# EAGLE design mapleCUx_large_056 (EAGLE 7.3.0)
MAPLE-CUx Large Version
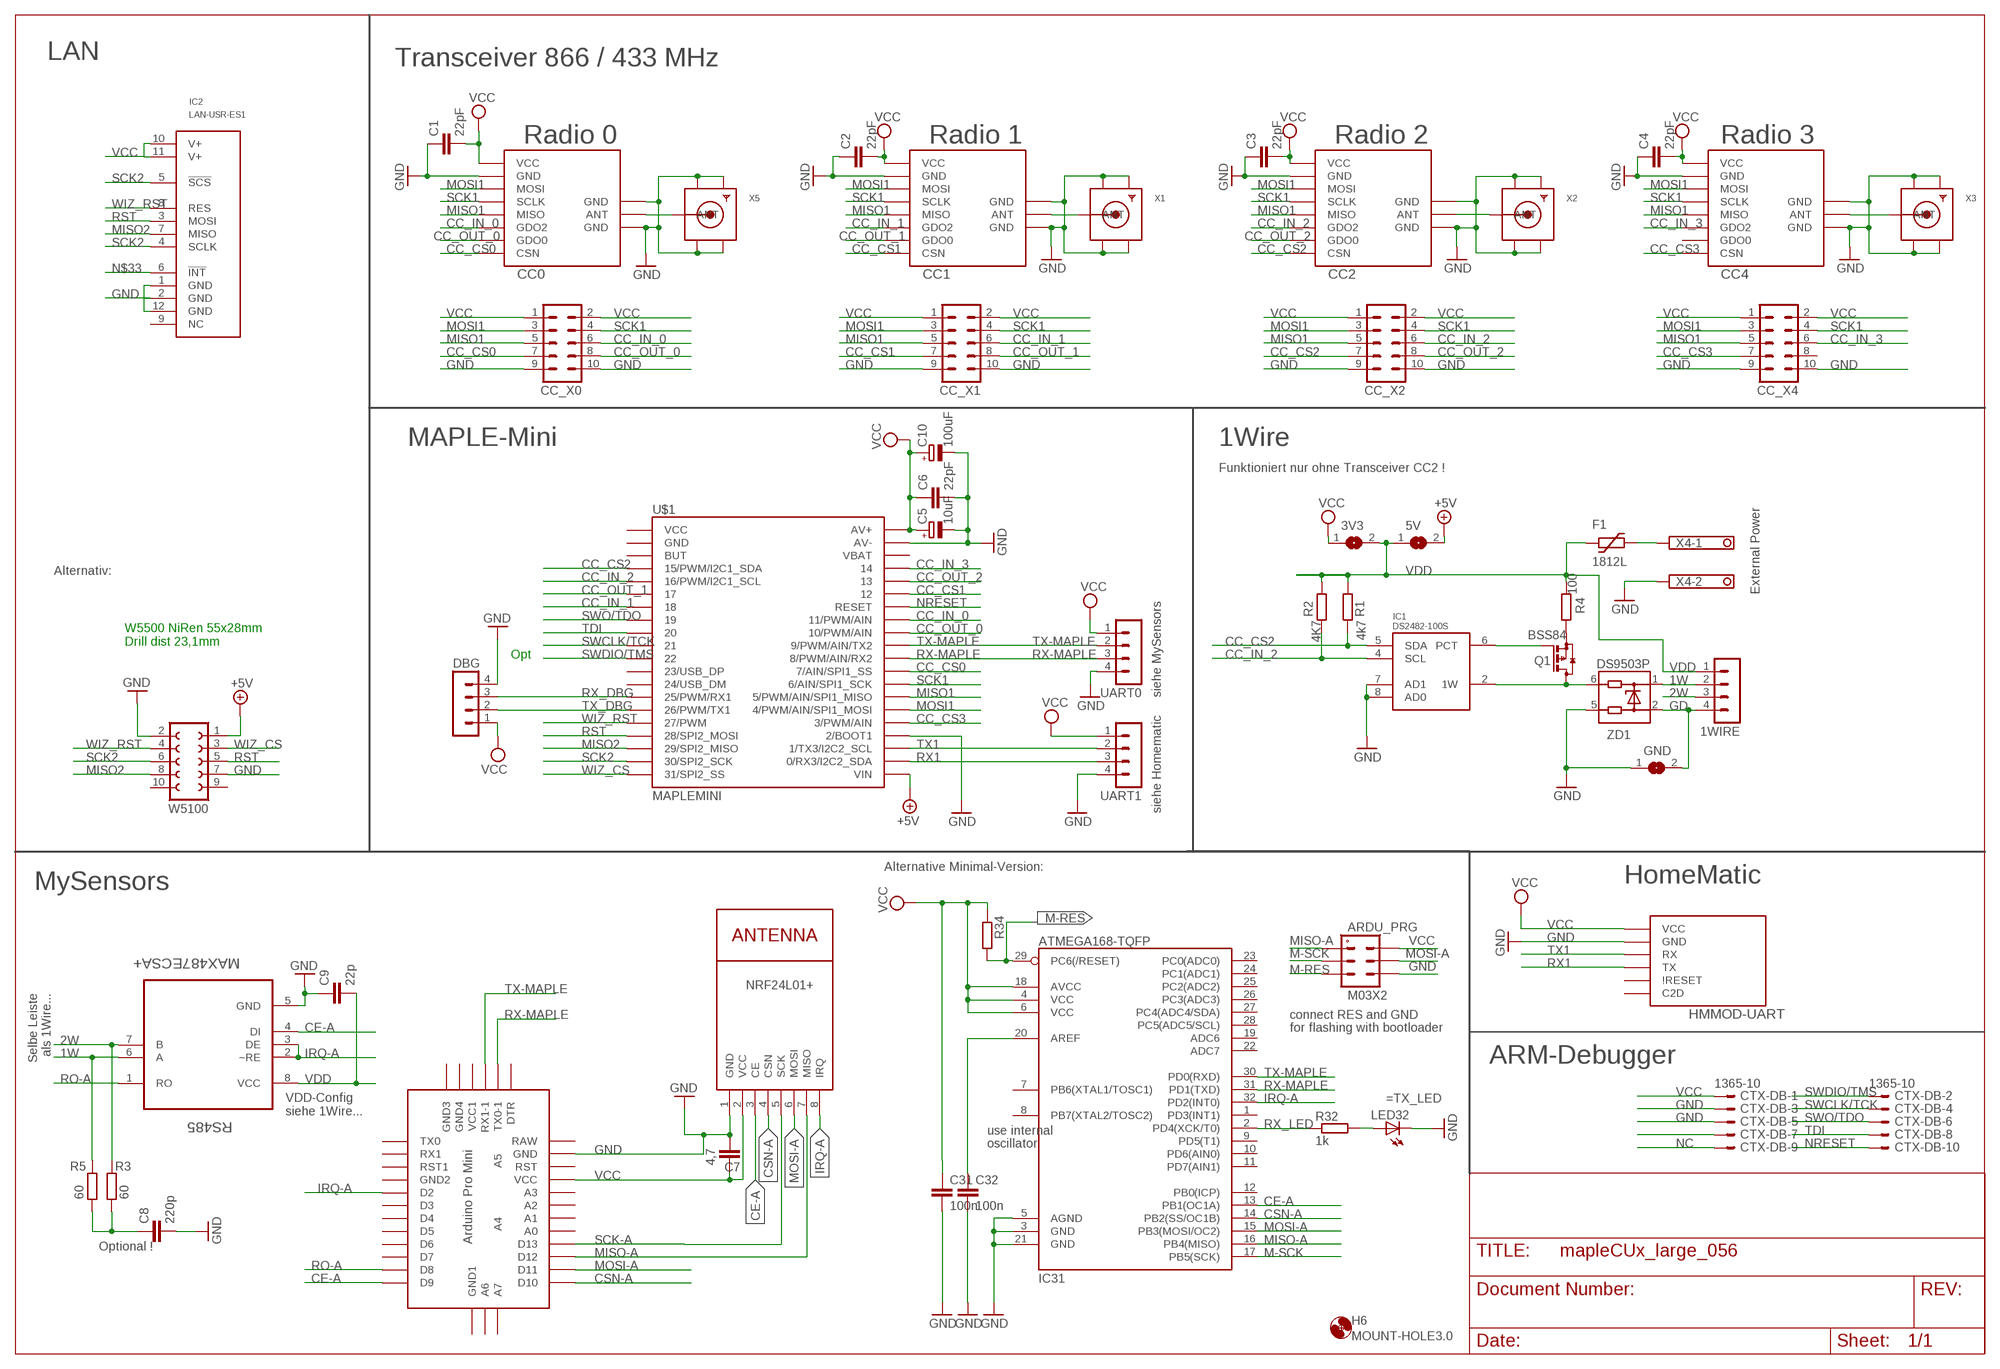
[diagram p0: schematic, sheet 1]

## Parts
1WIRE  MA04-1  [MA04-1]
3V3  SJ  [SJ]
5V  SJ  [SJ]
ARDU_PRG  M03X2  [2X03-1.27MM_SMD]
C1  22pF  C-EUC0805  [C0805]
C2  22pF  C-EUC0805  [C0805]
C3  22pF  C-EUC0805  [C0805]
C4  22pF  C-EUC0805  [C0805]
C5  10uF  CPOL-EUR/2012-12W  [R/2012-12W]
C6  22pF  C-EUC0805  [C0805]
C7  4,7  C-EUC1210  [C1210]
C8  220p  C-EUC0805  [C0805]
C9  22p  C-EUC0805  [C0805]
C10  100uF  CPOL-EUE5-8.5  [E5-8,5]
C31  100n  C-EUC0805  [C0805]
C32  100n  C-EUC0805  [C0805]
CC0  CC1101_MODULE1SMD  [CC1101_MODULE1_SMD]
CC1  CC1101_MODULE1SMD  [CC1101_MODULE1_SMD]
CC2  CC1101_MODULE1SMD  [CC1101_MODULE1_SMD]
CC4  CC1101_MODULE1SMD  [CC1101_MODULE1_SMD]
CC_X0  MA05-2  [MA05-2]
CC_X1  MA05-2  [MA05-2]
CC_X2  MA05-2  [MA05-2]
CC_X4  MA05-2  [MA05-2]
CTX-DB  1365-10  [1365-10]
DBG  MA04-1  [MA04-1]
F1  1812L  [1812L]
GND  SJ  [SJ]
H6  MOUNT-HOLE3.0  [3,0]
HMMOD-UART  HM-MOD-UARTDIL  [HM-MOD-UART-DIL]
IC1  DS2482-100S  [SO08]
IC2  LAN-USR-ES1  [USR-ES1]
IC31  ATMEGA168-TQFP  [TQFP32-08]
LED32  LEDCHIPLED_0805  [CHIPLED_0805]
NRF24L01+  NRF24L01+  WIRELESS-NRF24L01  [WIRELESS-NRF24L01]
Q1  BSS84  [SOT23]
R1  4k7  R-EU_R0805  [R0805]
R2  4K7  R-EU_R0805  [R0805]
R3  60  R-EU_R0805  [R0805]
R4  100  R-EU_R0805  [R0805]
R5  60  R-EU_R0805  [R0805]
R32  1k  R-EU_R0805  [R0805]
R34  R-EU_R0805  [R0805]
RS485  MAX487ECSA+  [SOIC127P600X175-8N]
U$1  MAPLEMINI  [20-DIP]
U$2  ABK-PRO-MINI  [ABK-PRO-MINI]
UART0  MA04-1  [MA04-1]
UART1  MA04-1  [MA04-1]
W5100  FE05-2  [FE05-2]
X1  SMACONNECTOR_EDGE_UFL  [SMA_EDGELAUNCH_UFL]
X2  SMACONNECTOR_EDGE_UFL  [SMA_EDGELAUNCH_UFL]
X3  SMACONNECTOR_EDGE_UFL  [SMA_EDGELAUNCH_UFL]
X4  1751248  [1751248]
X5  SMACONNECTOR_EDGE_UFL  [SMA_EDGELAUNCH_UFL]
ZD1  DS9503P  [TSOC6]

## Nets
1W: 1WIRE.2 R5.2 RS485.6(A) ZD1.1
2W: 1WIRE.3 R3.2 RS485.7(B)
+5V [PWR]: 5V.2 U$1.21(VIN) W5100.1
CC_CS0: CC0.CSN CC_X0.7 U$1.29(7/AIN/SPI1_SS)
CC_CS1: CC1.CSN CC_X1.7 U$1.35
CC_CS2: CC2.CSN CC_X2.7 IC1.5(SDA) R1.2 U$1.4(15/PWM/I2C1_SDA)
CC_CS3: CC4.CSN CC_X4.7 U$1.25(3/PWM/AIN)
CC_IN_0: CC0.GDO2 CC_X0.6 U$1.33(11/PWM/AIN)
CC_IN_1: CC1.GDO2 CC_X1.6 U$1.7
CC_IN_2: CC2.GDO2 CC_X2.6 IC1.4(SCL) R2.2 U$1.5(16/PWM/I2C1_SCL)
CC_IN_3: CC4.GDO2 CC_X4.6 U$1.37
CC_OUT_0: CC0.GDO0 CC_X0.8 U$1.32(10/PWM/AIN)
CC_OUT_1: CC1.GDO0 CC_X1.8 U$1.6
CC_OUT_2: CC2.GDO0 CC_X2.8 U$1.36
CE-A: IC31.13(PB1(OC1A)) NRF24L01+.3(CE) RS485.4(DI) U$2.D9
CSN-A: IC31.14(PB2(SS/OC1B)) NRF24L01+.4(CSN) U$2.D10
GD [PWR]: 1WIRE.4 GND.2 ZD1.2
GND [PWR]: ARDU_PRG.P$6 C1.1 C2.1 C3.1 C4.1 C5.- C6.2 C7.1 C8.2 C9.1 C10.- C31.2 C32.2 CC0.GND@0(GND) CC0.GND@1(GND) CC0.GND@2(GND) CC1.GND@0(GND) CC1.GND@1(GND) CC1.GND@2(GND) CC2.GND@0(GND) CC2.GND@1(GND) CC2.GND@2(GND) CC4.GND@0(GND) CC4.GND@1(GND) CC4.GND@2(GND) CC_X0.9 CC_X0.10 CC_X1.9 CC_X1.10 CC_X2.9 CC_X2.10 CC_X4.9 CC_X4.10 CTX-DB.3 CTX-DB.5 DBG.4 GND.1 HMMOD-UART.2(GND) IC1.7(AD1) IC1.8(AD0) IC2.1(GND) IC2.2(GND) IC2.12(GND) IC31.3(GND) IC31.5(AGND) IC31.21(GND) LED32.C NRF24L01+.1(GND) RS485.5(GND) U$1.24(2/BOOT1) U$1.39(AV-) U$2.GND UART0.4 UART1.4 W5100.2 W5100.7 X1.GND@1(GND1) X1.GND@2(GND2) X1.GND@3(GND3) X1.GND@4(GND4) X2.GND@1(GND1) X2.GND@2(GND2) X2.GND@3(GND3) X2.GND@4(GND4) X3.GND@1(GND1) X3.GND@2(GND2) X3.GND@3(GND3) X3.GND@4(GND4) X4.2 X5.GND@1(GND1) X5.GND@2(GND2) X5.GND@3(GND3) X5.GND@4(GND4) ZD1.5
IRQ-A: IC31.32(PD2(INT0)) NRF24L01+.8(IRQ) RS485.2(~RE) RS485.3(DE) U$2.D2
M-RES: ARDU_PRG.P$5 IC31.29(PC6(/RESET)) R34.2
M-SCK: ARDU_PRG.P$3 IC31.17(PB5(SCK))
MISO1: CC0.MISO CC1.MISO CC2.MISO CC4.MISO CC_X0.5 CC_X1.5 CC_X2.5 CC_X4.5 U$1.27(5/PWM/AIN/SPI1_MISO)
MISO2: IC2.7(MISO) U$1.18(29/SPI2_MISO) W5100.8
MISO-A: ARDU_PRG.P$1 IC31.16(PB4(MISO)) NRF24L01+.7(MISO) U$2.D12
MOSI1: CC0.MOSI CC1.MOSI CC2.MOSI CC4.MOSI CC_X0.3 CC_X1.3 CC_X2.3 CC_X4.3 U$1.26(4/PWM/AIN/SPI1_MOSI)
MOSI-A: ARDU_PRG.P$4 IC31.15(PB3(MOSI/OC2)) NRF24L01+.6(MOSI) U$2.D11
N$1: CC1.ANT X1.P(ANT)
N$2: CC4.ANT X3.P(ANT)
N$3: CC2.ANT X2.P(ANT)
N$4: CC0.ANT X5.P(ANT)
N$5: LED32.A R32.2
N$8: CTX-DB.7
N$15: C32.1 IC31.20(AREF)
N$21: C8.1 R3.1 R5.1
N$33: IC2.6(!INT!)
N$45 [PWR]: F1.P$2 X4.1
N$47: IC1.6(PCT) Q1.1(G)
N$48: IC1.2(1W) Q1.3(D) ZD1.6
N$52: Q1.2(S) R4.1
NC: CTX-DB.9
NRESET: CTX-DB.10 U$1.34(RESET)
RO-A: RS485.1(RO) U$2.D8
RST: IC2.3(MOSI) U$1.17(28/SPI2_MOSI) W5100.5
RX1: HMMOD-UART.5(TX) U$1.22(0/RX3/I2C2_SDA) UART1.3
RX-MAPLE: IC31.31(PD1(TXD)) U$1.30(8/PWM/AIN/RX2) U$2.TX0-1 UART0.3
RX_DBG: DBG.3 U$1.14(25/PWM/RX1)
RX_LED: IC31.2(PD4(XCK/T0)) R32.1
SCK1: CC0.SCLK CC1.SCLK CC2.SCLK CC4.SCLK CC_X0.4 CC_X1.4 CC_X2.4 CC_X4.4 U$1.28(6/AIN/SPI1_SCK)
SCK2: IC2.4(SCLK) IC2.5(!SCS!) U$1.19(30/SPI2_SCK) W5100.6
SCK-A: NRF24L01+.5(SCK) U$2.D13
SWCLK/TCK: CTX-DB.4 U$1.10
SWDIO/TMS: CTX-DB.2 U$1.11
SWO/TDO: CTX-DB.6 U$1.8
TDI: CTX-DB.8 U$1.9
TX1: HMMOD-UART.6(RX) U$1.23(1/TX3/I2C2_SCL) UART1.2
TX-MAPLE: IC31.30(PD0(RXD)) U$1.31(9/PWM/AIN/TX2) U$2.RX1-1 UART0.2
TX_DBG: DBG.2 U$1.15(26/PWM/TX1)
VCC [PWR]: 3V3.1 ARDU_PRG.P$2 C1.2 C2.2 C3.2 C4.2 C5.+ C6.1 C7.2 C10.+ C31.1 CC0.VCC CC1.VCC CC2.VCC CC4.VCC CC_X0.1 CC_X0.2 CC_X1.1 CC_X1.2 CC_X2.1 CC_X2.2 CC_X4.1 CC_X4.2 CTX-DB.1 DBG.1 HMMOD-UART.1(VCC) IC2.10(V+) IC2.11(V+) IC31.4(VCC) IC31.6(VCC) IC31.18(AVCC) NRF24L01+.2(VCC) R34.1 U$1.40(AV+) U$2.VCC UART0.1 UART1.1
VDD [PWR]: 1WIRE.1 3V3.2 5V.1 C9.2 F1.P$1 R1.1 R2.1 R4.2 RS485.8(VCC)
WIZ_CS: U$1.20(31/SPI2_SS) W5100.3
WIZ_RST: IC2.8(RES) U$1.16(27/PWM) W5100.4
Unconnected: CC4.GDO0 CC_X4.8 HMMOD-UART.3(C2D) HMMOD-UART.4(\!RESET) IC2.9(NC) IC31.1(PD3(INT1)) IC31.7(PB6(XTAL1/TOSC1)) IC31.8(PB7(XTAL2/TOSC2)) IC31.9(PD5(T1)) IC31.10(PD6(AIN0)) IC31.11(PD7(AIN1)) IC31.12(PB0(ICP)) IC31.19(ADC6) IC31.22(ADC7) IC31.23(PC0(ADC0)) IC31.24(PC1(ADC1)) IC31.25(PC2(ADC2)) IC31.26(PC3(ADC3)) IC31.27(PC4(ADC4/SDA)) IC31.28(PC5(ADC5/SCL)) U$1.1(VCC) U$1.2(GND) U$1.3(BUT) U$1.12(23/USB_DP) U$1.13(24/USB_DM) U$1.38(VBAT) U$2.A0 U$2.A1 U$2.A2 U$2.A3 U$2.A4 U$2.A5 U$2.A6 U$2.A7 U$2.D3 U$2.D4 U$2.D5 U$2.D6 U$2.D7 U$2.DTR U$2.GND1(GND2) U$2.GND2(GND3) U$2.GND3(GND4) U$2.GND4(GND1) U$2.RAW U$2.RST U$2.RST1 U$2.RX1 U$2.TX0 U$2.VCC1 W5100.9 W5100.10

## Notes on the sheet
- LAN | Transceiver 866 / 433 MHz
- Radio 0 | Radio 1 | Radio 2 | Radio 3
- MAPLE-Mini | 1Wire
- Funktioniert nur ohne Transceiver CC2 !
- Alternativ:
- External Power
- W5500 NiRen 55x28mm
  Drill dist 23,1mm
- Opt
- siehe MySensors
- siehe Homematic
- Alternative Minimal-Version:
- MySensors | HomeMatic
- Selbe Leiste
  als 1Wire...
- connect RES and GND
- for flashing with bootloader
- ARM-Debugger
- =TX_LED
- VDD-Config
  siehe 1Wire...
- use internal
- oscillator
- Optional !

## Power pins joined to a net without a drawn wire
GND: IC1.3(GND)
VDD: IC1.1(VDD)

## Library data of the parts
1WIRE DBG UART0 UART1 = con-lstb:MA04-1: PIN HEADER; OC_FARNELL: unknown; OC_NEWARK: unknown
3V3 5V GND = jumper:SJ: SMD solder JUMPER
ARDU_PRG = mechanics:M03X2
C1-C4 C6-C9 C31 C32 = rcl:C-EU: CAPACITOR, European symbol
C5 C10 = rcl:CPOL-EU: POLARIZED CAPACITOR, European symbol
CC0 CC1 CC2 CC4 = wireless:CC1101_MODULE1: CC1101 wireless module for 433/868 MHz (sold from Aliexpress). DIL version for mounting with pin header (and SMD soldering) and SMD only variant available.
CC_X0 CC_X1 CC_X2 CC_X4 = con-lstb:MA05-2: PIN HEADER; OC_FARNELL: unknown; OC_NEWARK: unknown
CTX-DB = con-leotronics:1365-10: DUAL ROW STRAIGHT HEADER 1364 SERIES. 1.27mm x 1.27mm. Without Fixing Post. SMT Source: http://www.leotronics.co.uk/Conexcon/Data%20Sheets/sec.%20A/1364ing.pdf; OC_FARNELL: unknown; OC_NEWARK: unknown
F1 = ptc-littlefuse:1812L
H6 = holes:MOUNT-HOLE: MOUNTING HOLE with drill center marker
HMMOD-UART = wireless:HM-MOD-UART: eQ3 HM-MOD-UART-AW-SH2 wireless module for 868 MHz. DIL version for mounting with pin header (antenna upwards) and SMD variant available (antenna downwards).
IC1 = 1wire:DS2482-100: I2C to 1-Wire Host Adapter/Line Driver This device is a onewire host and I2C interface in one chip. It provides the complete DC/AC requirements for onewire communication, including overdrive speed mode, but, unlike the DS2480B chip, no 12V EPROM programming. Notes: For overdrive speed and 5V EEPROM programming, an external active pullup circuit must be connected to the 1W, VDD and PCT pin. See the datasheet for details. The lower two I2C adress bits of the chip can be selected by external pins, so up to 4 chips may be connected to the same I2C bus. Author: Orginal device and description from Giovanni Varasano <giovanni.varasano@fastwebnet.it> Improved by Jan Kandziora <jjj@gmx.de>
IC2 = Martin-Communication:LAN-USR-ES1
IC31 = atmel:ATMEGA168: Atmel Atmega 168/328/328P
LED32 = led:LED: LED OSRAM: - CHIPLED LG R971, LG N971, LY N971, LG Q971, LY Q971, LO R971, LY R971 LH N974, LH R974 LS Q976, LO Q976, LY Q976 LO Q996 - Hyper CHIPLED LW Q18S LB Q993, LB Q99A, LB R99A - SideLED LS A670, LO A670, LY A670, LG A670, LP A670 LB A673, LV A673, LT A673, LW A673 LH A674 LY A675 LS A676, LA A676, LO A676, LY A676, LW A676 LS A679, LY A679, LG A679 - Hyper Micro SIDELED® LS Y876, LA Y876, LO Y876, LY Y876 LT Y87S - SmartLED LW L88C, LW L88S LB L89C, LB L89S, LG L890 LS L89K, LO L89K, LY L89K LS L896, LA L896, LO L896, LY L896 - TOPLED LS T670, LO T670, LY T670, LG T670, LP T670 LSG T670, LSP T670, LSY T670, LOP T670, LYG T670 LG T671, LOG T671, LSG T671 LB T673, LV T673, LT T673, LW T673 LH T674 LS T676, LA T676, LO T676, LY T676, LB T676, LH T676, LSB T676, LW T676 LB T67C, LV T67C, LT T67C, LS T67K, LO T67K, LY T67K, LW E67C LS E67B, LA E67B, LO E67B, LY E67B, LB E67C, LV E67C, LT E67C LW T67C LS T679, LY T679, LG T679 LS T770, LO T770, LY T770, LG T770, LP T770 LB T773, LV T773, LT T773, LW T773 LH T774 LS E675, LA E675, LY E675, LS T675 LS T776, LA T776, LO T776, LY T776, LB T776 LHGB T686 LT T68C, LB T68C - Hyper Mini TOPLED® LB M676 - Mini TOPLED Santana® LG M470 LS M47K, LO M47K, LY M47K Source: http://www.osram.convergy.de LUXEON: - LUMILED® LXK2-PW12-R00, LXK2-PW12-S00, LXK2-PW14-U00, LXK2-PW14-V00 LXK2-PM12-R00, LXK2-PM12-S00, LXK2-PM14-U00 LXK2-PE12-Q00, LXK2-PE12-R00, LXK2-PE12-S00, LXK2-PE14-T00, LXK2-PE14-U00 LXK2-PB12-K00, LXK2-PB12-L00, LXK2-PB12-M00, LXK2-PB14-N00, LXK2-PB14-P00, LXK2-PB14-Q00 LXK2-PR12-L00, LXK2-PR12-M00, LXK2-PR14-Q00, LXK2-PR14-R00 LXK2-PD12-Q00, LXK2-PD12-R00, LXK2-PD12-S00 LXK2-PH12-R00, LXK2-PH12-S00 LXK2-PL12-P00, LXK2-PL12-Q00, LXK2-PL12-R00 Source: www.luxeon.com KINGBRIGHT: KA-3528ASYC Source: www.kingbright.com
NRF24L01+ = diy-modules:WIRELESS-NRF24L01: 2.4 GHz Wireless Module based on NRF24L01 chip
Q1 = transistor-small-signal:BSS84: P-CHANNEL MOS FET
R1-R5 R32 R34 = rcl:R-EU_: RESISTOR, European symbol
RS485 = Maxim_By_element14_Batch_1:MAX487ECSA+: Low-Power, Slew-Rate-Limited RS-485/RS-422 Transceivers; MPN: MAX487ECSA+; OC_FARNELL: 9724532; OC_NEWARK: 68K4803; PACKAGE: SOIC-8; SUPPLIER: Maxim
U$1 = maplemini-small:MAPLEMINI
U$2 = Arduino-clone:ABK-PRO-MINI: ABK Pro-Mini Arduino Clone
W5100 = con-lsta:FE05-2: FEMALE HEADER; OC_FARNELL: unknown; OC_NEWARK: unknown
X1-X3 X5 = adafruit:SMACONNECTOR: SMA Connector 90° DIP SMA Connector, 50 Ohm (4UConnector: 07259)
X4 = con-phoenix-350:1751248: MKDS 1/ 2-3,5 Printklemme Nennstrom: 10 A Bemessungsspannung: 160 V Raster: 3,5 mm Polzahl: 2 Montageart: Löten Anschlussart: Schraubanschluss Anschlussrichtung vom Leiter zur Platine: 0° Source: http://eshop.phoenixcontact.com .. 1751248.pdf; OC_FARNELL: unknown; OC_NEWARK: unknown
ZD1 = 1wire:DS9503: ESD Protection Diode with Resistors This ESD protection diode is designed especially for onewire host interfaces. Unlike the DS9502, it has two additional 5Ohm resitors in the 1W and GND line. Pin 5 and 6 have to be connected to the host side, pin 1 und 2 to the network side. The 1W line is through pin 1 and 6, the GND line is through pin 2 and 5. Author: Jan Kandziora <jjj@gmx.de>

## Net classes
1 PWR: width 0.508 mm

## Board
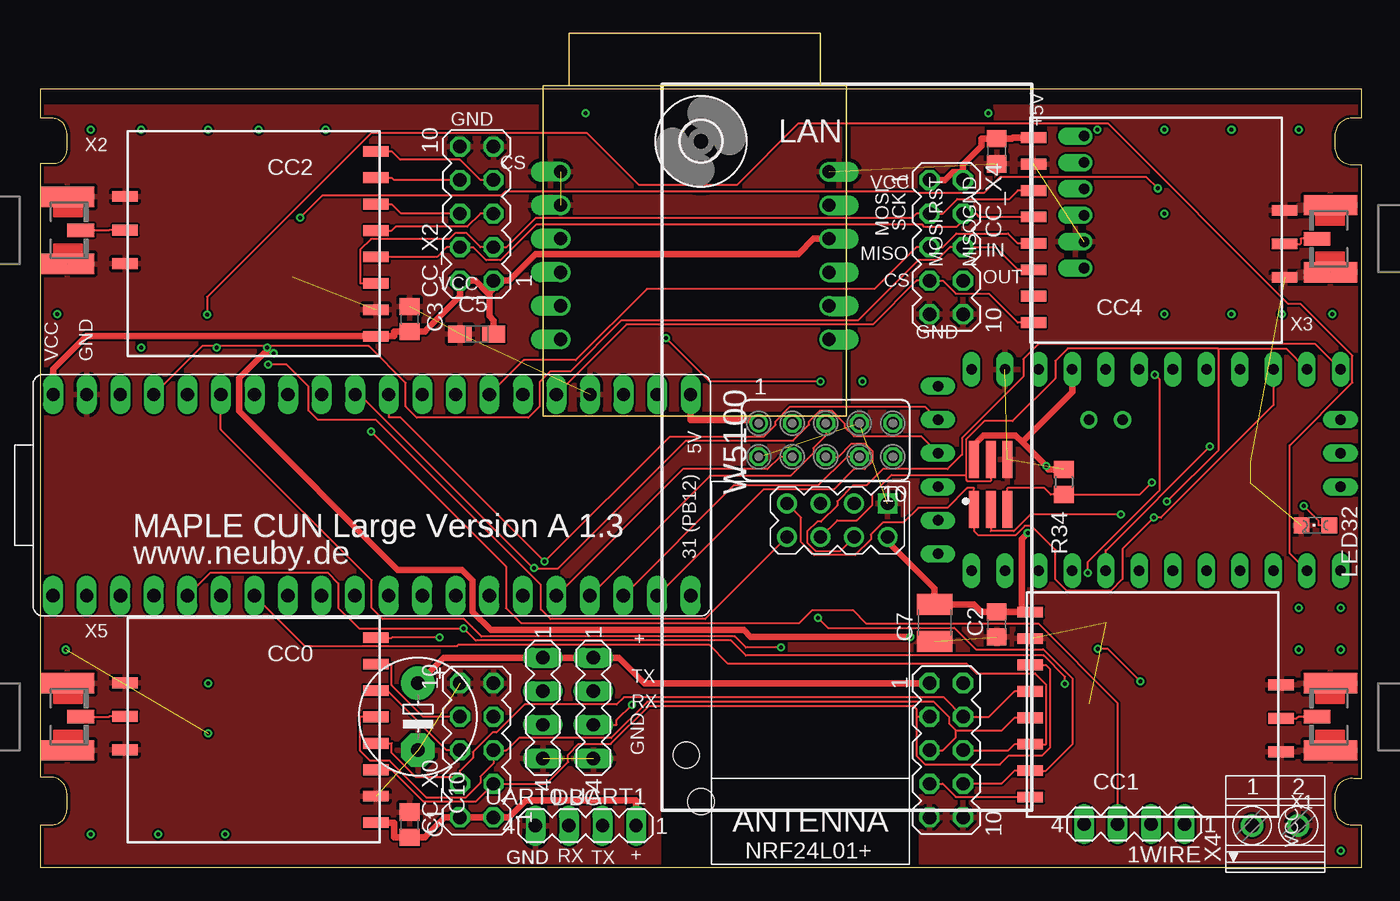
[diagram p1: board, top side]
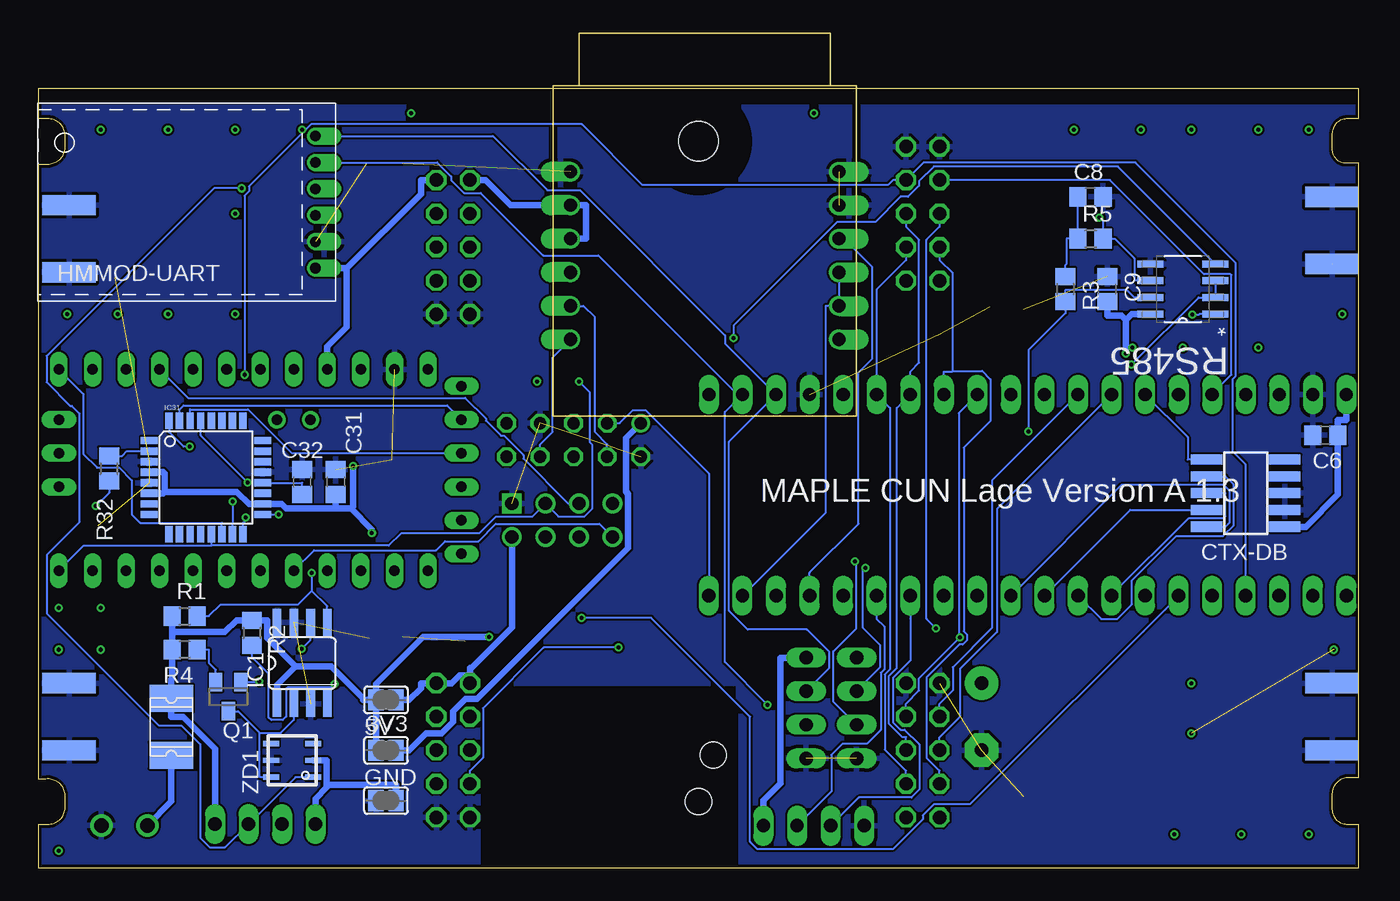
[diagram p2: board, bottom side, seen from below]

Size 100 x 59 mm. Coordinates in mm from the lower left corner, seen from the top.
Outline: 0,0 0,3.25 0.84,3.25 arc90 2,4.41 2,5.59 arc90 0.76,6.86 0,6.86 0,53.34 1.02,53.34 arc90 2,54.41 2,55.59 arc90 0.84,56.75 0,56.75 0,59 100,59 100,56.75 99.41,56.75 arc90 98,55.59 98,54.41 arc90 99.41,53.25 100,53.25 100,6.75 99.41,6.75 arc90 98,5.59 98,4.41 arc90 99.41,3.25 100,3.25 100,0 0,0
Copper layers (1*16): Top 0.035mm / dielectric 1.5mm / Bottom 0.035mm
Design rules "SeeedStudio_2layer_DRU_no_angle_20140221": minimum track width 6mil, minimum drill 12mil, track to track 6mil, track to pad 6mil, pad to pad 6mil, via to via 6mil, smd to smd 0mil, copper to edge 10mil, drill to drill 10mil, minimum pad ring 10mil, minimum via ring 6mil, stop-mask expansion 2mil, vias tented up to drill 100mil, thermal gap 10mil
Holes 2 mm at 48.9,8.53 50,5
tRestrict: area 0,58 to 100,59; area 47,0 to 66,12
bRestrict: area 0,58 to 100,59; area 0,58 to 100,59; area 47,0 to 66,12

### Footprints (pad centres in the part's own frame; a part is rotated, then mirrored left to right if it is on the bottom)
MA04-1 = drill 1.016 long: 1 -3.81,0; 2 -1.27,0; 3 1.27,0; 4 3.81,0
SJ = smd 1.168 x 1.6: 1 -0.762,0; 2 0.762,0
2X03-1.27MM_SMD = smd 0.75 x 2.8: P$1 -1.27,-1.905; P$2 -1.27,1.905; P$3 0,-1.905; P$4 0,1.905; P$5 1.27,-1.905; P$6 1.27,1.905
C0805 = smd 1.3 x 1.5: 1 -0.95,0; 2 0.95,0
R/2012-12W = smd 1.75 x 1.26: + 1.275,0; - -1.275,0
C1210 = smd 1.6 x 2.7: 1 -1.4,0; 2 1.4,0
E5-8,5 = drill 1.016 pad 2.54: + -2.54,0 | drill 1.016 pad 2.54 octagon: - 2.54,0
CC1101_MODULE1_SMD = smd 1.93 x 0.813: ANT 19,5.96; CSN 0,0; GDO0 0,2; GDO2 0,4; GND@0 0,12; GND@1 19,8.5; GND@2 19,3.42; MISO 0,6; MOSI 0,10; SCLK 0,8; VCC 0,14
MA05-2 = drill 1.016 octagon: 1 -5.08,-1.27; 2 -5.08,1.27; 3 -2.54,-1.27; 4 -2.54,1.27; 5 0,-1.27; 6 0,1.27; 7 2.54,-1.27; 8 2.54,1.27; 9 5.08,-1.27; 10 5.08,1.27
1365-10 = smd 0.76 x 2.4: 1 -2.54,-2.95; 2 -2.54,2.95; 3 -1.27,-2.95; 4 -1.27,2.95; 5 0,-2.95; 6 0,2.95; 7 1.27,-2.95; 8 1.27,2.95; 9 2.54,-2.95; 10 2.54,2.95
1812L = smd 2.03 x 3.3: P$1 -2.16,0; P$2 2.16,0
3,0 = hole 3: 0,0
HM-MOD-UART-DIL = drill 0.8 offset: 1 0,12; 2 0,10; 3 0,8; 4 0,6; 5 0,4; 6 0,2
SO08 = smd 0.66 x 2.032: 1 -1.905,-3.073; 2 -0.635,-3.073; 3 0.635,-3.073; 4 1.905,-3.073; 5 1.905,3.073; 6 0.635,3.073; 7 -0.635,3.073; 8 -1.905,3.073
USR-ES1 = drill 1 pad 1.35 offset: 1 -10.16,5.715; 2 -10.16,3.175; 3 -10.16,0.635; 4 -10.16,-1.905; 5 -10.16,-4.445; 6 -10.16,-6.985; 7 10.16,-6.985; 8 10.16,-4.445; 9 10.16,-1.905; 10 10.16,0.635; 11 10.16,3.175; 12 10.16,5.715
TQFP32-08 = smd 1.27 x 0.559: 1 -4.293,2.8; 2 -4.293,2; 3 -4.293,1.2; 4 -4.293,0.4; 5 -4.293,-0.4; 6 -4.293,-1.2; 7 -4.293,-2; 8 -4.293,-2.8; 17 4.293,-2.8; 18 4.293,-2; 19 4.293,-1.2; 20 4.293,-0.4; 21 4.293,0.4; 22 4.293,1.2; 23 4.293,2; 24 4.293,2.8 | smd 0.559 x 1.27: 9 -2.8,-4.293; 10 -2,-4.293; 11 -1.2,-4.293; 12 -0.4,-4.293; 13 0.4,-4.293; 14 1.2,-4.293; 15 2,-4.293; 16 2.8,-4.293; 25 2.8,4.293; 26 2,4.293; 27 1.2,4.293; 28 0.4,4.293; 29 -0.4,4.293; 30 -1.2,4.293; 31 -2,4.293; 32 -2.8,4.293
CHIPLED_0805 = smd 1.2 x 1.2: A 0,-1.05; C 0,1.05
WIRELESS-NRF24L01 = drill 1 square: 1 -12.7,6.35 | drill 1: 2 -10.16,6.35; 3 -12.7,3.81; 4 -10.16,3.81; 5 -12.7,1.27; 6 -10.16,1.27; 7 -12.7,-1.27; 8 -10.16,-1.27
SOT23 = smd 1 x 1.4: 1 -0.95,-1.1; 2 0.95,-1.1; 3 0,1.1
R0805 = smd 1.3 x 1.5: 1 -0.95,0; 2 0.95,0
SOIC127P600X175-8N = smd 1.981 x 0.533: 1 -2.464,1.905; 2 -2.464,0.635; 3 -2.464,-0.635; 4 -2.464,-1.905; 5 2.464,-1.905; 6 2.464,-0.635; 7 2.464,0.635; 8 2.464,1.905
20-DIP = drill 1.016 pad 1.27 long: 1 -24.13,-7.62; 2 -21.59,-7.62; 3 -19.05,-7.62; 4 -16.51,-7.62; 5 -13.97,-7.62; 6 -11.43,-7.62; 7 -8.89,-7.62; 8 -6.35,-7.62; 9 -3.81,-7.62; 10 -1.27,-7.62; 11 1.27,-7.62; 12 3.81,-7.62; 13 6.35,-7.62; 14 8.89,-7.62; 15 11.43,-7.62; 16 13.97,-7.62; 17 16.51,-7.62; 18 19.05,-7.62; 19 21.59,-7.62; 20 24.13,-7.62 | drill 1 pad 1.27 long: 21 24.13,7.62; 22 21.59,7.62; 23 19.05,7.62; 24 16.51,7.62; 25 13.97,7.62; 26 11.43,7.62; 27 8.89,7.62; 28 6.35,7.62; 29 3.81,7.62; 30 1.27,7.62; 31 -1.27,7.62; 32 -3.81,7.62; 33 -6.35,7.62; 34 -8.89,7.62; 35 -11.43,7.62; 36 -13.97,7.62; 37 -16.51,7.62; 38 -19.05,7.62; 39 -21.59,7.62; 40 -24.13,7.62
ABK-PRO-MINI = drill 0.8 long: A0 10.16,-3.81; A1 10.16,-6.35; A2 10.16,-8.89; A3 10.16,-11.43; A6 3.81,-21.59; A7 6.35,-21.59; D2 -5.08,-3.81; D3 -5.08,-6.35; D4 -5.08,-8.89; D5 -5.08,-11.43; D6 -5.08,-13.97; D7 -5.08,-16.51; D8 -5.08,-19.05; D9 -5.08,-21.59; D10 10.16,-21.59; D11 10.16,-19.05; D12 10.16,-16.51; D13 10.16,-13.97; DTR 8.89,8.89; GND 10.16,3.81; GND1 -5.08,-1.27; GND2 -3.81,8.89; GND3 -1.27,8.89; GND4 1.27,-21.59; RAW 10.16,6.35; RST 10.16,1.27; RST1 -5.08,1.27; RX1 -5.08,3.81; RX1-1 3.81,8.89; TX0 -5.08,6.35; TX0-1 6.35,8.89; VCC 10.16,-1.27; VCC1 1.27,8.89 | drill 0.8: A4 6.35,-5.08; A5 6.35,-2.54
FE05-2 = drill 0.914: 1 -5.08,1.27 | drill 0.914 octagon: 2 -5.08,-1.27; 3 -2.54,1.27; 4 -2.54,-1.27; 5 0,1.27; 6 0,-1.27; 7 2.54,1.27; 8 2.54,-1.27; 9 5.08,1.27; 10 5.08,-1.27
SMA_EDGELAUNCH_UFL = smd 4.064 x 1.524: GND@1 2.032,-2.54; GND@2 2.032,2.54 | smd 4.064 x 1.524 bottom: GND@3 2.032,2.54; GND@4 2.032,-2.54 | smd 2.032 x 1.016: P 3.048,0
1751248 = drill 1.1 pad 1.7: 1 -1.75,-0.1; 2 1.75,-0.1
TSOC6 = smd 0.406 x 1.219: 1 -1.27,-1.6; 2 0,-1.6; 3 1.27,-1.6; 4 1.27,1.6; 5 0,1.6; 6 -1.27,1.6

### Placement (x,y rotation side)
1WIRE  82.8,3.3 180 top
3V3  73.66,12.7 180 bottom
5V  73.66,8.89 0 bottom
ARDU_PRG  71.94,29.02 0 top
C1  27.94,3.25 270 top
C2  72.39,18.41 90 top
C3  27.94,41.55 270 top
C4  72.39,54.24 90 top
C5  33.02,40.4 0 top
C6  2.54,32.75 180 bottom
C7  67.69,18.54 90 top
C8  20.32,50.8 0 bottom
C9  19.05,43.81 270 bottom
C10  28.57,11.43 270 top
C31  77.47,29.21 90 bottom
C32  80.01,29.21 90 bottom
CC0  25.4,17.41 180 top
CC1  74.93,5.35 0 top
CC2  25.4,54.24 180 top
CC4  75.18,41.27 0 top
CC_X0  33.02,8.89 90 top
CC_X1  68.58,8.89 270 top
CC_X2  33.02,49.53 90 top
CC_X4  68.58,46.99 270 top
CTX-DB  8.58,28.36 90 bottom
DBG  41.27,3.17 180 top
F1  89.92,10.67 270 bottom
GND  73.66,5.08 0 bottom
H6  50,55 0 top
HMMOD-UART  78.99,57.4 180 bottom
IC1  80.01,15.49 0 bottom
IC2  49.53,46.99 0 top
IC31  87.29,29.55 0 bottom
LED32  96.52,25.93 90 top
NRF24L01+  57.78,14.88 270 top
Q1  85.6,12.95 180 bottom
R1  88.9,19.05 0 bottom
R2  83.82,17.78 270 bottom
R3  22.23,43.81 270 bottom
R4  88.9,16.51 180 bottom
R5  20.32,47.62 0 bottom
R32  94.63,30.22 270 bottom
R34  77.47,29.21 270 top
RS485  13.34,43.81 180 bottom
U$1  25.08,28.21 0 top
U$2  76.83,27.57 90 top
UART0  38.03,12.09 270 top
UART1  41.85,12.09 270 top
W5100  59.45,32.38 0 top
X1  99.69,11.43 180 top
X2  0,48.26 0 top
X3  99.69,47.62 180 top
X4  93.47,3.3 0 top
X5  0,11.43 0 top
ZD1  80.77,8.13 90 bottom

### Tracks (layer width: path | path; a pad name or v marks a point on that pad's centre or on a via)
1W  (via drill 0.3 pad 0.61)
  Top 0.152: v84.58,51.44 83.73,52.29 72.63,52.29 71.43,51.08 66.39,51.08 66.28,51.19 35.17,51.19 34.86,50.88 21.3,50.88 v19.64,49.21
  Bottom 0.152: ZD1.1 80.52,6.86 1WIRE.2 85.85,1.52 87.01,1.52 87.73,2.25 87.73,9.36 89.15,10.78 90.86,10.78 99.35,19.26 99.35,23.69 96.88,26.16 96.88,34.39 97.45,34.96 97.56,34.96 99.36,36.76 99.36,38.76 86.67,51.44 v84.58,51.44 | RS485.6 17.02,44.45 17.02,46.15 18.49,47.62 R5.2 19.37,48.95 v19.64,49.21
2W  (via drill 0.3 pad 0.61)
  Top 0.152: v25.03,33.02 35.24,22.8 35.24,19.66 36.38,18.53 57.45,18.53 58.43,19.5 61.49,19.5 62.51,18.49 75.53,18.49 81.53,12.48 1WIRE.3
  Bottom 0.152: RS485.7 17.02,43.18 17.58,43.74 22.23,43.74 R3.2 22.23,41.99 25.03,39.19 v25.03,33.02
+5V
  Top 0.508: W5100.1 54.11,33.92 49.21,33.92 U$1.21
  Bottom 0.508: 5V.2 71.91,8.89 70.64,10.16 69.46,10.16 68.58,11.04 68.58,11.85 67.62,12.8 66.76,12.8 55.34,24.22 55.34,28.32 55.49,28.47 55.49,32.53 W5100.1
CC_CS0  (via drill 0.3 pad 0.61)
  Top 0.152: CC0.CSN 26.59,17.41 26.62,17.44 v30.21,17.44
  Bottom 0.152: U$1.29 30.3,34.43 30.3,17.52 v30.21,17.44 33.3,14.35 33.3,13.41 34.29,12.42 CC_X0.7
CC_CS1  (via drill 0.3 pad 0.61)
  Top 0.152: v56.07,16.68 53.39,16.68 52.56,17.51 33.38,17.51 32.06,18.84 25.9,18.84 25.08,19.66 25.08,21.76 13.65,33.19 U$1.35 | CC_X1.7 68.3,6.35 69.3,5.35 CC1.CSN
  Bottom 0.152: CC_X1.7 67.31,7.34 66.32,8.33 66.32,12.07 61.72,16.68 v56.07,16.68
CC_CS2  (via drill 0.3 pad 0.61)
  Top 0.152: v79.28,22.34 79.28,23.13 84.73,28.59 84.73,36.97 v84.38,37.32 | CC2.CSN 26.59,54.24 27.23,53.61 31.76,53.61 33.3,52.07 CC_X2.7
  Bottom 0.152: U$1.4 8.57,30.52 9.55,31.51 9.55,36.99 9.32,37.22 9.32,45.79 16.93,53.39 32.97,53.39 CC_X2.7 35.28,52.07 35.65,51.7 54.22,51.7 58.83,56.3 79.35,56.3 84.04,51.61 84.04,51.22 84.38,50.88 v84.38,37.32 | R1.2 87.07,19.05 86.19,19.93 80.32,19.93 79.28,20.97 | IC1.5 78.11,19.81 78.12,19.81 79.28,20.97 | v79.28,22.34 79.28,20.97
CC_CS3
  Top 0.152: U$1.25 44.35,41.13 63,41.13 66.32,44.45 CC_X4.7 68.3,44.45 69.29,43.46 71.81,43.46 73.99,41.27 CC4.CSN
CC_IN_0
  Top 0.152: CC_X0.6 30.76,8.89 26.23,13.41 CC0.GDO2
  Bottom 0.152: CC_X0.6 31.75,9.88 30.2,11.43 30.2,15.04 27.39,17.84 27.39,27.17 U$1.33
CC_IN_1
  Top 0.152: U$1.7 20,16.78 31.55,16.78 31.66,16.89 50.59,16.89 52.01,15.47 70.09,15.47 70.84,14.71 75.28,14.71 76.12,13.87 76.12,9.35 CC1.GDO2 73.74,9.35 73.28,8.89 CC_X1.6
CC_IN_2  (via drill 0.3 pad 0.61)
  Top 0.152: U$1.5 12.87,22.34 21.74,22.34 22.54,21.54 22.54,19.69 24.11,18.12 v32.02,18.12 32.95,17.2 52.27,17.2 53.41,16.06 75.95,16.06 77.56,14.46 v77.56,13.91 | CC2.GDO2 26.59,50.24 27.31,49.53 CC_X2.6
  Bottom 0.152: CC_X2.6 31.75,48.54 32.74,47.55 32.74,18.85 v32.02,18.12 | R2.2 83.82,15.95 82.53,14.66 82.53,11.36 82.35,11.18 81.48,11.18 81.2,11.46 81.2,13.53 81.07,13.66 78.11,13.66 | 78.11,13.66 78.11,13.59 IC1.4 | v77.56,13.91 77.8,13.66 78.11,13.66
CC_IN_3
  Top 0.152: U$1.37 12.22,39.48 24.86,39.48 27.64,36.71 27.64,34.93 28.48,34.09 36.94,34.09 37.78,34.93 37.78,36.77 38.59,37.58 40.11,37.58 43.96,41.44 61.89,41.44 66.46,46 67.87,46 68.86,46.99 CC_X4.6 72.28,46.99 73.99,45.27 CC4.GDO2
CC_OUT_0
  Top 0.152: CC0.GDO0 26.59,15.41 26.59,13.81 28.97,11.43 CC_X0.8
  Bottom 0.152: CC_X0.8 31.75,12.42 30.76,13.41 30.76,15.18 27.78,18.16 27.78,29.32 U$1.32
CC_OUT_1  (via drill 0.3 pad 0.61)
  Top 0.152: v58.86,18.92 59.61,18.17 69.18,18.17 70.81,16.54 75.91,16.54 78.1,14.35 78.1,9.33 76.12,7.35 CC1.GDO0 73.74,7.35 72.74,6.35 CC_X1.8
  Bottom 0.152: U$1.6 29.44,4.8 32.18,4.8 33.02,3.96 33.02,3.67 35.29,1.41 45.52,1.41 46.09,1.97 46.09,11.43 53.58,18.92 v58.86,18.92
CC_OUT_2
  Top 0.152: CC2.GDO0 26.59,52.24 26.77,52.07 CC_X2.8
  Bottom 0.152: U$1.36 11.11,35.87 9.65,37.33 9.65,44.87 9.72,44.95 11.73,44.95 18.85,52.07 CC_X2.8
CE-A  (via drill 0.3 pad 0.61)
  Top 0.152: v59.05,36.8 50.66,36.8 v47.35,40.11
  Bottom 0.152: v59.05,36.8 58.23,35.97 58.23,32.21 58.04,32.02 58.04,27.2 58.65,26.59 60.61,26.59 NRF24L01+.3 62.6,26.57 65.36,26.57 66.6,25.33 72.52,25.33 73.46,24.39 86.89,24.39 | RS485.4 18.24,53.09 32.2,53.09 33.3,51.99 33.3,51.64 34.14,50.8 34.7,50.8 36.61,48.9 39.5,48.9 47.35,41.05 v47.35,40.11 | IC31.13 86.89,24.39 | U$2.D9 96.53,24.39 86.89,24.39
CSN-A
  Top 0.152: U$2.D10 96.52,39.65 75.55,39.65 74.4,38.5 74.4,37.19 69.76,32.55 69.76,31.27 68.67,30.18 63.77,30.18 62.54,28.94 61.52,28.94 60.33,27.75 60.33,27.44 59.1,26.21 58.81,26.21 58.04,25.44 58.04,24.63 58.67,24 60.56,24 NRF24L01+.4
  Bottom 0.152: IC31.14 86.09,26.12 92.27,26.12 92.91,26.76 92.91,29.33 93.87,30.29 95.53,30.29 96.57,31.33 96.57,35.88 U$2.D10
GD
  Bottom 0.508: 78.16,6.29 78.16,6.07 78.99,5.23 1WIRE.4 | 78.16,6.29 78.16,8.13 ZD1.2 | 78.16,6.29 72.9,6.29 GND.2
GND  (21 unrouted)
  pour Bottom: 0,59 0.13,0 46.99,0 46.99,13.97 66.67,13.97 66.67,0 100,0 100,59
  pour Top: 0.13,0 0,59 100,59 100,0 66.67,0 66.67,13.97 46.99,13.97 46.99,0
IRQ-A  (via drill 0.3 pad 0.61)
  Top 0.152: NRF24L01+.8 50.31,18.83 38.6,18.83 37.89,19.54 37.89,21.4 25.39,33.9 21,33.9 20.29,34.62 20.29,36.42 18.63,38.09 v17.23,38.09 | U$2.D2 80.64,24.03 80.69,24.03 v88.53,31.88
  Bottom 0.152: RS485.3 RS485.2 12.14,43.18 v17.23,38.09 | U$2.D2 79.11,24.03 69.89,24.03 69.21,24.71 66.67,24.71 65.35,26.03 57.51,26.03 NRF24L01+.8 | IC31.32 90.09,32.97 89,31.88 v88.53,31.88
M-RES  (via drill 0.3 pad 0.61)
  Top 0.152: v84.14,29.18 83.22,28.26 R34.2 76.98,28.26 76.49,28.26 76.01,28.74 73.21,28.74 ARDU_PRG.P$5
  Bottom 0.152: v84.14,29.18 87.69,32.73 IC31.29
M-SCK  (via drill 0.3 pad 0.61)
  Top 0.152: v81.78,26.75 74.94,26.75 73.69,25.49 71.94,25.49 ARDU_PRG.P$3
  Bottom 0.152: IC31.17 82.13,26.75 v81.78,26.75
MISO1
  Top 0.152: U$1.27 36.57,38.43 40.52,38.43 45.91,43.81 63.14,43.81 66.32,46.99 CC_X4.5 68.3,46.99 69.33,48.02 73.25,48.02 73.99,47.27 CC4.MISO | 69.29,10.41 68.8,10.91 68.8,11.39 67.62,12.56 45.94,12.56 43.2,9.82 36.22,9.82 35.28,8.89 CC_X0.5 34.29,7.9 33.3,6.91 33.3,6.43 32.17,5.3 29.24,5.3 26.44,8.11 24.96,8.11 24.21,8.86 24.21,11.41 CC0.MISO | 69.29,10.41 69.29,9.88 68.3,8.89 CC_X1.5 | 69.29,10.41 72.8,10.41 73.74,11.35 CC1.MISO | CC2.MISO 26.59,48.24 26.89,48.54 32.31,48.54 33.3,49.53 CC_X2.5
  Bottom 0.152: CC_X2.5 34.29,48.54 33.3,47.55 33.3,38.24 33.97,37.57 U$1.27 34.98,34.82 34.98,15.11 35.59,14.51 35.59,10.89 34.57,9.88 34.29,9.88 CC_X0.5
MISO2
  Top 0.152: W5100.8 61.05,31.11 58.87,28.94 52.48,28.94 U$1.18
  Bottom 0.152: W5100.8 61.99,32.05 61.05,32.99 61.05,38.64 IC2.7
MISO-A  (via drill 0.3 pad 0.61)
  Top 0.152: NRF24L01+.7 57.59,26.5 57.59,24.65 58.57,23.66 61.67,23.66 62.87,24.85 62.87,25.22 63.77,26.13 65.31,26.13 66.44,27.26 68.66,27.26 70.14,28.74 70.67,28.74 ARDU_PRG.P$1 70.67,25.49 70.99,25.17 73.8,25.17 74.51,25.88 75.03,25.88 76.83,24.07 76.83,21.83 77.71,20.95 81.02,20.95 81.92,21.85 81.92,24.14 v84.28,26.5 84.83,26.5 93.34,35.02 U$2.D12
  Bottom 0.152: v84.28,26.5 84.28,26.33 84.49,26.12 IC31.16
MOSI1
  Top 0.152: 66.32,11.43 66.32,12.01 66.07,12.25 46.06,12.25 43.17,9.36 40.74,9.36 39.94,8.56 39.94,8 38.29,6.35 CC_X0.3 32.94,5 29.01,5 26.59,7.42 CC0.MOSI | CC2.MOSI 24.21,44.24 24.21,46.8 25.01,47.61 30.95,47.61 31.37,48.03 32.26,48.03 33.3,46.99 CC_X2.3 35.28,46.99 37.47,49.18 65.97,49.18 66.32,49.53 CC_X4.3 67.81,49.53 68.3,49.53 69.41,50.64 73.36,50.64 73.99,51.27 CC4.MOSI | CC1.MOSI 76.12,15.35 76.45,15.02 76.45,9.11 75.85,8.5 73.32,8.5 72.64,7.82 66.96,7.82 66.32,8.46 66.32,11.43 | CC_X1.3 66.32,11.43
  Bottom 0.152: CC_X0.3 34.29,7.34 35.89,8.94 35.89,14.63 35.5,15.03 35.5,34.81 U$1.26 36.51,43.78 34.29,46 CC_X2.3
MOSI-A  (via drill 0.3 pad 0.61)
  Top 0.152: 70.07,29.74 70.07,29.38 70.15,29.3 71.94,29.3 ARDU_PRG.P$4 | 89.2,39.27 89.16,39.31 77.76,39.31 76.82,38.37 76.82,37.04 73.59,33.81 71.46,33.81 70.07,32.42 70.07,29.74 | NRF24L01+.6 60.33,26.3 61.8,26.3 62.97,27.48 62.97,28.29 64.42,29.74 70.07,29.74 | 89.2,39.27 89.23,39.3 94.32,39.3 U$2.D11 | v85.29,27.72 89.2,31.64 89.2,39.27
  Bottom 0.152: IC31.15 85.29,26.12 v85.29,27.72
N$1
  Top 0.152: CC1.ANT 95.12,11.31 95.24,11.43 X1.P
N$2
  Top 0.152: X3.P 95.4,47.62 95.4,47.26 95.38,47.23 CC4.ANT
N$3
  Top 0.152: CC2.ANT 5.21,48.28 5.18,48.26 X2.P
N$4
  Top 0.152: CC0.ANT 5.21,11.46 5.18,11.43 X5.P
N$5  (via drill 0.3 pad 0.61)
  Top 0.152: LED32.A 96.74,25.93 96.74,26.28 v95.63,27.39
  Bottom 0.152: R32.2 94.63,28.39 v95.63,27.39
N$6  (via drill 0.3 pad 0.61)
  other vias: 3.81,55.88
N$7  (via drill 0.3 pad 0.61)
  other vias: 1.27,41.91
N$9  (via drill 0.3 pad 0.61)
  other vias: 3.81,2.54
N$10  (via drill 0.3 pad 0.61)
  other vias: 8.89,2.54
N$11  (via drill 0.3 pad 0.61)
  other vias: 13.97,2.54
N$13  (via drill 0.3 pad 0.61)
  other vias: 7.62,55.88
N$14  (via drill 0.3 pad 0.61)
  other vias: 12.7,55.88
N$15
  Bottom 0.152: C32.1 80.01,29.14 80.02,29.14 IC31.20
N$16  (via drill 0.3 pad 0.61)
  other vias: 95.25,55.88
N$17  (via drill 0.3 pad 0.61)
  other vias: 90.17,55.88
N$18  (via drill 0.3 pad 0.61)
  other vias: 85.09,55.88
N$19  (via drill 0.3 pad 0.61)
  other vias: 80.01,55.88
N$20  (via drill 0.3 pad 0.61)
  other vias: 85.09,41.91
N$21
  Bottom 0.152: R3.1 22.23,45.64 22.15,45.72 22.15,47.62 R5.1 C8.1
N$22  (via drill 0.3 pad 0.61)
  other vias: 7.62,39.37
N$23  (via drill 0.3 pad 0.61)
  other vias: 13.34,39.37
N$24  (via drill 0.3 pad 0.61)
  other vias: 90.17,41.91
N$25  (via drill 0.3 pad 0.61)
  other vias: 17.14,39.37
N$26  (via drill 0.3 pad 0.61)
  other vias: 62.23,36.83
N$27  (via drill 0.3 pad 0.61)
  other vias: 41.27,57.15
N$28  (via drill 0.3 pad 0.61)
  other vias: 12.7,13.97
N$30  (via drill 0.3 pad 0.61)
  other vias: 85.09,49.53
N$31  (via drill 0.3 pad 0.61)
  other vias: 71.75,57.15
N$35  (via drill 0.3 pad 0.61)
  other vias: 98.42,1.27
N$36  (via drill 0.3 pad 0.61)
  other vias: 21.59,55.88
N$37  (via drill 0.3 pad 0.61)
  other vias: 16.51,55.88
N$38  (via drill 0.3 pad 0.61)  (1 unrouted)
  other vias: 12.7,10.16 1.91,16.51
N$39  (via drill 0.3 pad 0.61)
  other vias: 93.98,41.91
N$40  (via drill 0.3 pad 0.61)
  other vias: 98.42,16.51
N$41  (via drill 0.3 pad 0.61)
  other vias: 95.25,16.51
N$42  (via drill 0.3 pad 0.61)
  other vias: 98.42,19.68
N$43  (via drill 0.3 pad 0.61)
  other vias: 95.25,19.68
N$44  (via drill 0.3 pad 0.61)
  other vias: 97.79,41.91
N$45
  Bottom 0.508: X4.1 89.92,5.01 F1.P$2
N$47  (via drill 0.3 pad 0.61)
  Top 0.152: v83.28,14.1 80.8,16.58 v80.04,16.58
  Bottom 0.152: v80.04,16.58 79.38,17.24 IC1.6 | Q1.1 83.32,14.05 v83.28,14.1
N$48
  Bottom 0.152: 83.21,10.2 84.87,11.85 Q1.3 | 83.21,10.2 83.21,6.86 ZD1.6 | 83.21,10.2 81.63,10.2 80.64,11.18 IC1.2
N$52
  Bottom 0.152: Q1.2 86.55,14.98 87.07,15.51 87.07,16.51 R4.1
NRESET
  Bottom 0.152: CTX-DB.10 12.96,30.9 12.96,32.59 U$1.34
RO-A  (via drill 0.3 pad 0.61)
  Top 0.152: U$2.D8 94.57,23.81 94.57,31.98 99.31,36.72 99.31,38.78 95.4,42.69 94.48,42.69 80.84,56.32 57.34,56.32 52.71,51.7 45.31,51.7 41.37,55.64 25.03,55.64 12.6,43.21 v12.6,41.9
  Bottom 0.152: RS485.1 12.09,41.91 12.1,41.9 v12.6,41.9
RST
  Top 0.152: W5100.5 59.45,32.72 58.51,31.77 58.51,31.39 56.79,29.66 50.67,29.66 U$1.17
  Bottom 0.152: U$1.17 41.59,22.34 37.89,26.05 37.89,37.5 36.85,38.55 36.85,45.47 39.01,47.62 IC2.3
RX1  (via drill 0.3 pad 0.61)
  Top 0.152: UART1.3 43.61,10.81 43.61,11.18 v44.77,12.34
  Bottom 0.152: v44.77,12.34 48,15.57 48,34.51 46.86,35.64 | 46.86,35.64 U$1.22 | HMMOD-UART.5 69.78,53.4 68.72,52.34 68.72,52.06 67.74,51.08 66.49,51.08 61.77,46.35 57.58,46.35 46.86,35.64
RX-MAPLE  (via drill 0.3 pad 0.61)
  Top 0.152: U$2.TX0-1 66.96,34.91 56.76,34.91 55.64,33.8 55.64,33.53 54.76,32.65 47.64,32.65 v38.17,23.18 27.26,34.09 26.35,34.09 U$1.30
  Bottom 0.152: UART0.3 39.78,12.57 39.78,16.38 38.06,18.11 38.06,23.07 v38.17,23.18 | IC31.31 89.29,34.7 88.98,35.01 69.03,35.01 U$2.TX0-1
RX_DBG
  Bottom 0.152: U$1.14 33.97,18.84 33.97,15.69 35.28,14.38 35.28,11.02 34.7,10.44 34.41,10.44 33.29,9.32 33.29,5.92 33.88,5.33 37.85,5.33 DBG.3
RX_LED
  Bottom 0.152: R32.1 93.65,31.17 93.28,31.55 IC31.2
SCK1
  Top 0.152: CC0.SCLK 26.59,9.41 26.59,8.69 28.44,6.84 31.75,6.84 | 31.75,6.84 31.75,7.34 32.74,8.33 32.74,8.76 34.21,10.23 34.52,10.23 36.66,12.36 43.62,12.36 44.16,12.9 68.38,12.9 CC_X1.4 70.34,11.43 70.84,11.43 71.82,11.43 73.74,13.35 CC1.SCLK | CC_X0.4 31.75,6.84 | 70.34,49.53 69.33,48.51 66.92,48.51 66.76,48.68 37.5,48.68 34.82,46 33.73,46 32.74,46.99 CC_X2.4 30.76,46.99 30.01,46.24 CC2.SCLK | 70.34,49.53 70.84,49.53 71.1,49.27 CC4.SCLK | CC_X4.4 70.34,49.53
  Bottom 0.152: 30.76,37.61 28.51,37.61 27.88,36.98 27.88,33.83 29.91,31.8 29.91,17.89 29.68,17.66 29.68,17.22 29.99,16.9 30.24,16.9 32.74,14.4 32.74,8.33 31.75,7.34 CC_X0.4 | U$1.28 31.43,37.57 30.8,37.57 30.76,37.61 | 30.76,37.61 30.76,45.01 31.75,46 CC_X2.4
SCK2
  Top 0.152: W5100.6 60.39,31.11 61.38,32.1 62.43,32.1 62.97,31.56 62.97,30.77 62.38,30.18 61.59,30.18 60.05,28.63 54.72,28.63 U$1.19
  Bottom 0.152: U$1.19 40.35,26.91 40.35,42.55 IC2.5 IC2.4
SCK-A
  Bottom 0.152: U$2.D13 88.65,35.58 67.66,35.58 66.09,34.01 66.09,33.84 64.96,32.72 64.74,32.72 63.26,31.24 63.26,30.97 59.87,27.57 NRF24L01+.5
SWCLK/TCK
  Bottom 0.152: U$1.10 17.31,27.09 CTX-DB.4
SWDIO/TMS
  Bottom 0.152: CTX-DB.2 10.1,25.82 9.79,26.13 9.79,28.53 10.23,28.97 17.98,28.97 U$1.11
SWO/TDO
  Bottom 0.152: U$1.8 18.73,20.64 12.9,26.48 10.23,26.48 10.1,26.61 10.1,28.36 CTX-DB.6
TDI
  Bottom 0.152: U$1.9 19.51,18.82 18.3,18.82 17.18,19.94 17.18,21.76 13.84,25.11 10.3,25.11 9.48,25.93 9.48,29 10.1,29.63 CTX-DB.8
TX1
  Bottom 0.152: UART1.2 40.1,15.11 40.1,16.33 41.8,18.04 46.28,18.04 47.69,19.44 47.69,32.27 U$1.23 47.98,39.68 47.98,40.3 58.98,51.29 61.45,51.29 65.56,55.4 HMMOD-UART.6
TX-MAPLE  (via drill 0.3 pad 0.61)
  Top 0.152: U$2.RX1-1 66.66,32.67 61.57,32.67 60.87,33.36 60.87,33.63 59.9,34.6 59,34.6 58.18,33.78 58.18,33.55 56.97,32.34 48.87,32.34 39.18,22.64 37.42,22.64 v37.37,22.7 37.28,22.7 24.16,35.83 U$1.31
  Bottom 0.152: UART0.2 38.03,13.4 36.24,15.19 36.24,16.84 37.56,18.17 37.56,22.51 v37.37,22.7 | IC31.30 88.49,34.7 84.12,34.7 80.8,31.39 U$2.RX1-1
TX_DBG
  Bottom 0.152: U$1.15 36.51,18.84 35.93,18.26 35.93,15.03 36.2,14.77 36.2,10.44 37.25,9.38 39.09,9.38 39.94,8.53 39.94,5.78 DBG.2
VCC  (via drill 0.3 pad 0.61)
  Top 0.508: 74.3,19.35 74.3,24.91 v74.73,25.35 | 74.3,19.35 73.56,19.35 73.55,19.36 C2.2 71.23,19.36 70.66,19.94 C7.2 67.69,21.15 64.14,24.7 NRF24L01+.2 | 74.3,19.35 74.88,19.35 CC1.VCC | CC_X1.1 45.71,13.97 43.78,15.89 UART1.1 UART0.1 36.1,15.89 30.5,15.89 C10.+ | 74.32,32.23 73.82,32.73 71.39,32.73 70.67,32.01 ARDU_PRG.P$2 | 74.32,32.23 78.11,36.02 U$2.VCC | 74.32,32.23 v76.15,30.4 76.31,30.24 76.31,30.16 R34.1 | DBG.1 45.09,5.11 36.75,5.11 35.46,3.81 CC_X0.1 CC_X0.2 30.58,3.81 29.1,2.33 29.1,2.31 C1.2 26.78,2.31 26.78,3.4 26.77,3.42 CC0.VCC | 33.98,43.55 33.82,43.55 32.92,44.45 CC_X2.2 31.75,43.28 29.1,40.63 29.1,40.59 C3.2 27.36,40.59 26.78,40.59 26.78,40.26 26.77,40.24 CC2.VCC 24.03,40.24 3.45,40.24 0.95,37.74 U$1.40 | 33.98,43.55 33.98,41.76 34.3,41.44 C5.+ | 34.87,44.45 33.98,43.55 | 34.87,44.45 35.46,44.45 37.47,46.47 57.37,46.47 58.53,47.62 IC2.10 | CC_X2.1 34.87,44.45 | CC_X4.1 68.48,52.07 69.06,52.65 69.85,52.65 | 69.85,52.65 69.85,53.24 71.23,54.62 71.23,55.2 C4.2 73.55,55.2 73.63,55.27 CC4.VCC | CC_X4.2 69.85,52.65
  Bottom 0.508: 76.31,27.2 76.15,27.37 v76.15,30.4 | 77.47,27.2 76.31,27.2 | v74.73,25.35 74.73,25.62 76.31,27.2 | 77.47,27.2 81.23,27.2 81.57,27.55 81.96,27.55 82.48,27.55 IC31.18 84.04,27.55 84.95,28.46 90.43,28.46 | 90.43,28.46 90.54,28.34 IC31.6 | 90.43,28.46 90.43,29.83 90.54,29.95 IC31.4 | C31.1 77.47,27.2 | 76.63,45.4 76.63,40.93 78.11,39.45 U$2.VCC | CC_X4.2 71.02,52.07 71.02,51.01 76.63,45.4 | HMMOD-UART.1 76.63,45.4 | IC2.10 58.53,47.62 58.53,50.16 IC2.11 64.24,50.16 66.14,52.07 CC_X4.1 | 67.31,14.55 68.1,14.55 68.68,13.97 CC_X1.2 71.02,13.97 71.02,13.59 71.91,12.7 3V3.1 | 67.31,14.55 67.31,15.14 67.19,15.14 64.14,18.2 NRF24L01+.2 | CC_X1.1 67.31,14.55 | DBG.1 45.09,5.11 43.78,6.41 43.78,15.89 UART1.1 | CTX-DB.1 4.02,25.82 1.59,28.25 C6.1 1.59,33.91 0.96,33.91 0.95,33.92 U$1.40
VDD  (via drill 0.3 pad 0.61)
  Top 0.508: v17.63,38.95 16.9,38.95 15.03,37.08 15.03,34.57 27.05,22.54 31.91,22.54 32.7,21.75 32.7,19.38 34.09,17.99 53.24,17.99 53.76,17.47 v65.87,17.47
  Bottom 0.508: 89.85,17.84 R4.2 89.85,14.32 89.92,14.25 F1.P$1 89.92,11.41 89.03,11.41 86.61,8.99 1WIRE.1 | 80.52,15.24 77.83,15.24 75.41,12.82 75.41,12.7 3V3.2 | 80.52,15.24 82.66,17.38 82.66,18.73 R2.1 84.98,18.73 85.87,17.84 89.85,17.84 | 80.52,15.24 81.92,13.84 IC1.1 | R1.1 89.85,17.84 | 17.64,41.46 17.63,41.45 v17.63,38.95 | 17.64,41.46 17.99,41.81 19.05,41.81 C9.2 | 17.64,41.46 17.2,41.91 RS485.8 | 3V3.2 74.42,13.91 70.86,17.47 v65.87,17.47 | 3V3.2 74.42,11.49 5V.1
WIZ_CS
  Bottom 0.152: W5100.3 55.97,33.66 54.97,34.65 54.03,34.65 49.21,29.84 U$1.20
WIZ_RST
  Top 0.152: W5100.4 55.97,31.11 55.03,30.18 48.64,30.18 U$1.16
  Bottom 0.152: IC2.8 58.71,42.55 57.85,41.69 57.85,32.99 56.91,32.05 W5100.4

### Text on the board
tNames: +5V | GND | LAN | CS | RST | GND | VCC | MOSI | MISO | MOSI | SCK | MISO | IN | VCC | CS | OUT | GND | VCC | GND | W5100 | 5V | MAPLE CUN Large Version A 1.3 | MAPLE CUN Large Version A 1.3 | www.neuby.de | 31 (PB12) | + | TX | RX | GND | VCC | GND | GND | + | RX | TX
bNames: MAPLE CUN Lage Version A 1.3